# EAGLE design boatColorControlBiggerButtonV4 (EAGLE 8.6.3)
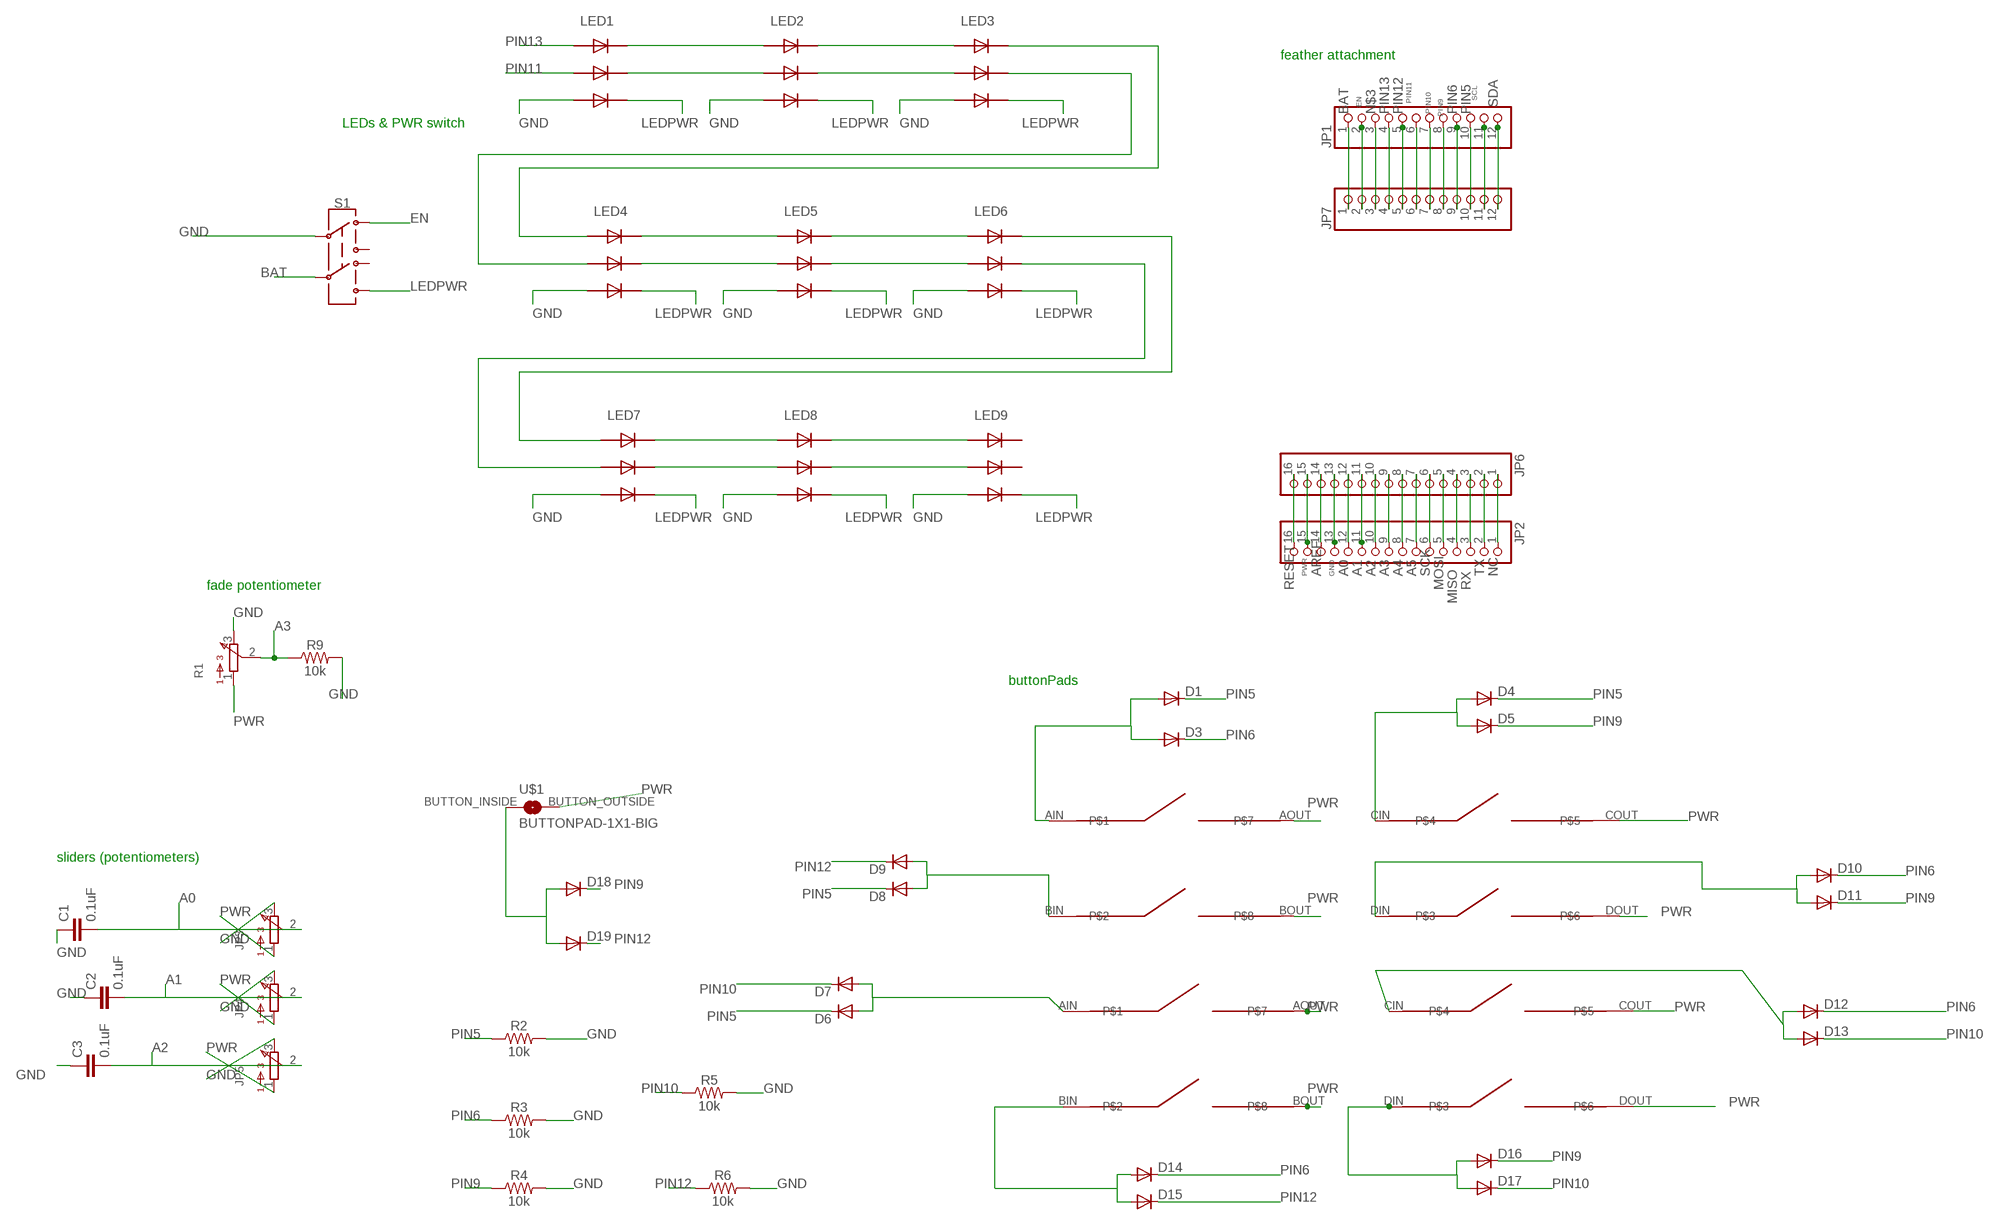
[diagram p0: schematic, sheet 1]

## Parts
C1  0.1uF  0.1UF-0603-25V-5%  [0603]
C2  0.1uF  0.1UF-0603-25V-5%  [0603]
C3  0.1uF  0.1UF-0603-25V-5%  [0603]
D1  DIODESOD123  [SOD123]
D3  DIODESOD123  [SOD123]
D4  DIODESOD123  [SOD123]
D5  DIODESOD123  [SOD123]
D6  DIODESOD123  [SOD123]
D7  DIODESOD123  [SOD123]
D8  DIODESOD123  [SOD123]
D9  DIODESOD123  [SOD123]
D10  DIODESOD123  [SOD123]
D11  DIODESOD123  [SOD123]
D12  DIODESOD123  [SOD123]
D13  DIODESOD123  [SOD123]
D14  DIODESOD123  [SOD123]
D15  DIODESOD123  [SOD123]
D16  DIODESOD123  [SOD123]
D17  DIODESOD123  [SOD123]
D18  DIODESOD123  [SOD123]
D19  DIODESOD123  [SOD123]
JP1  PINHD-1X12  [1X12]
JP2  PINHD-1X16  [1X16]
JP3  BOURNESPOTENTIOMETER  [BOURNESPOTENTIOMETER]
JP4  BOURNESPOTENTIOMETER  [BOURNESPOTENTIOMETER]
JP5  BOURNESPOTENTIOMETER  [BOURNESPOTENTIOMETER]
JP6  PINHD-1X16  [1X16]
JP7  PINHD-1X12  [1X12]
LED1  RGBLED_DOTSTAR5050  [RGBLED5050_DOTSTAR]
LED2  RGBLED_DOTSTAR5050  [RGBLED5050_DOTSTAR]
LED3  RGBLED_DOTSTAR5050  [RGBLED5050_DOTSTAR]
LED4  RGBLED_DOTSTAR5050  [RGBLED5050_DOTSTAR]
LED5  RGBLED_DOTSTAR5050  [RGBLED5050_DOTSTAR]
LED6  RGBLED_DOTSTAR5050  [RGBLED5050_DOTSTAR]
LED7  RGBLED_DOTSTAR5050  [RGBLED5050_DOTSTAR]
LED8  RGBLED_DOTSTAR5050  [RGBLED5050_DOTSTAR]
LED9  RGBLED_DOTSTAR5050  [RGBLED5050_DOTSTAR]
R1  PTV_BOURNES_POT  [PVT_BOURNES_POT]
R2  10k  10KOHM-0603-1/10W-1%  [0603]
R3  10k  10KOHM-0603-1/10W-1%  [0603]
R4  10k  10KOHM-0603-1/10W-1%  [0603]
R5  10k  10KOHM-0603-1/10W-1%  [0603]
R6  10k  10KOHM-0603-1/10W-1%  [0603]
R9  10k  10KOHM-0603-1/10W-1%  [0603]
S1  SWITCH-DPDT-PTH-GPI-152-3013  [SWITCH_DPDT_CRFS-2202W]
U$1  BUTTONPAD-1X1-BIG  [BUTTONPAD-1X1]
U$9  BUTTONPAD2X2  [BUTTONPAD-2X2]
U$13  BUTTONPAD2X2  [BUTTONPAD-2X2]

## Nets
A0: C1.2 JP2.12 JP3.2 JP6.12
A1: C2.2 JP2.11 JP4.2 JP6.11
A2: C3.2 JP2.10 JP5.2 JP6.10
A3: JP2.9 JP6.9 R1.2 R9.1
A4: JP2.8 JP6.8
A5: JP2.7 JP6.7
AREF: JP2.14 JP6.14
BAT: JP1.1 JP7.1 S1.C@2
EN: JP1.2 JP7.2 S1.10
GND: C1.1 C2.1 C3.1 JP2.13 JP3.3 JP4.3 JP5.3 JP6.13 LED1.GND LED2.GND LED3.GND LED4.GND LED5.GND LED6.GND LED7.GND LED8.GND LED9.GND R1.3 R2.2 R3.2 R4.2 R5.2 R6.2 R9.2 S1.C@1
LEDPWR: LED1.VCC LED2.VCC LED3.VCC LED4.VCC LED5.VCC LED6.VCC LED7.VCC LED8.VCC LED9.VCC S1.21
MISO: JP2.4 JP6.4
MOSI: JP2.5 JP6.5
N$3: JP1.3 JP7.3
N$4: LED1.DATAOUT LED2.DATAIN
N$5: LED1.CLOCKOUT LED2.CLOCKIN
N$6: LED2.DATAOUT LED3.DATAIN
N$7: LED2.CLOCKOUT LED3.CLOCKIN
N$8: LED4.DATAOUT LED5.DATAIN
N$9: LED4.CLOCKOUT LED5.CLOCKIN
N$10: LED5.DATAOUT LED6.DATAIN
N$11: LED5.CLOCKOUT LED6.CLOCKIN
N$12: LED7.DATAOUT LED8.DATAIN
N$13: LED7.CLOCKOUT LED8.CLOCKIN
N$14: LED8.DATAOUT LED9.DATAIN
N$15: LED8.CLOCKOUT LED9.CLOCKIN
N$16: LED3.CLOCKOUT LED4.CLOCKIN
N$17: LED3.DATAOUT LED4.DATAIN
N$18: LED6.DATAOUT LED7.DATAIN
N$19: LED6.CLOCKOUT LED7.CLOCKIN
N$21: D1.ANODE(A) D3.ANODE(A) U$9.AIN
N$22: D4.ANODE(A) D5.ANODE(A) U$9.CIN
N$23: D6.ANODE(A) D7.ANODE(A) U$13.AIN
N$24: D8.ANODE(A) D9.ANODE(A) U$9.BIN
N$25: D10.ANODE(A) D11.ANODE(A) U$9.DIN
N$26: D12.ANODE(A) D13.ANODE(A) U$13.CIN
N$27: D14.ANODE(A) D15.ANODE(A) U$13.BIN
N$28: D16.ANODE(A) D17.ANODE(A) U$13.DIN
N$30: D18.ANODE(A) D19.ANODE(A) U$1.BUTTON_INSIDE(BUTTONINSIDE)
NC: JP2.1 JP6.1
PIN5: D1.CATHODE(C) D4.CATHODE(C) D6.CATHODE(C) D8.CATHODE(C) JP1.10 JP7.10 R2.1
PIN6: D3.CATHODE(C) D10.CATHODE(C) D12.CATHODE(C) D14.CATHODE(C) JP1.9 JP7.9 R3.1
PIN9: D5.CATHODE(C) D11.CATHODE(C) D16.CATHODE(C) D18.CATHODE(C) JP1.8 JP7.8 R4.1
PIN10: D7.CATHODE(C) D13.CATHODE(C) D17.CATHODE(C) JP1.7 JP7.7 R5.1
PIN11: JP1.6 JP7.6 LED1.CLOCKIN
PIN12: D9.CATHODE(C) D15.CATHODE(C) D19.CATHODE(C) JP1.5 JP7.5 R6.1
PIN13: JP1.4 JP7.4 LED1.DATAIN
PWR: JP2.15 JP3.1 JP4.1 JP5.1 JP6.15 R1.1 U$1.BUTTON_OUTSIDE(BUTTONOUTSIDE) U$9.AOUT U$9.BOUT U$9.COUT U$9.DOUT U$13.AOUT U$13.BOUT U$13.COUT U$13.DOUT
RESET: JP2.16 JP6.16
RX: JP2.3 JP6.3
SCK: JP2.6 JP6.6
SCL: JP1.11 JP7.11
SDA: JP1.12 JP7.12
TX: JP2.2 JP6.2
Unconnected: LED9.CLOCKOUT LED9.DATAOUT S1.11 S1.20

## Notes on the sheet
- feather attachment
- LEDs & PWR switch
- fade potentiometer
- buttonPads
- sliders (potentiometers)

## Library data of the parts
C1-C3 = SparkFun-Capacitors:0.1UF: 0.1µF ceramic capacitors A capacitor is a passive two-terminal electrical component used to store electrical energy temporarily in an electric field.; PROD_ID: CAP-08604
D1 D3-D19 = trellisLaura:DIODE: DIODE high speed (Philips)
JP1 JP7 = pinhead:PINHD-1X12: PIN HEADER
JP2 JP6 = pinhead:PINHD-1X16: PIN HEADER
JP3-JP5 = trellisLaura:BOURNESPOTENTIOMETER: Laura custom potentiometer https://www.digikey.com/product-detail/en/bourns-inc/PTA4543-2010CIB103/PTA4543-2010CIB103-ND/3781197 Part ID: Bourns Inc. PTA4543-2010CIB103 Datasheet: http://www.bourns.com/docs/Product-Datasheets/pta.pdf
LED1-LED9 = trellisLaura:RGBLED_DOTSTAR: For 5050 RGB LEDs, the order of the LEDs may vary from one manufacturer to another!
R1 = trellisLaura:PTV_BOURNES_POT: PVT09 Series Potentiometer from Bournes http://www.bourns.com/docs/Product-Datasheets/PTV09.pdf part created by hand by Laura Feb 2018
R2-R6 R9 = SparkFun-Resistors:10KOHM: 10kΩ resistor A resistor is a passive two-terminal electrical component that implements electrical resistance as a circuit element. Resistors act to reduce current flow, and, at the same time, act to lower voltage levels within circuits. - Wikipedia; PROD_ID: RES-00824
S1 = trellisLaura:SWITCH-DPDT: Double-Pole, Double-Throw (DPDT) Switch Double-pole, double-throw switches. Variant Overview PTH-GPI-152-3013 Used on SparkFun Geiger Counter <https://www.sparkfun.com/products/11345> SMD-AY0202 Surface Mount DPDT Switch <https://www.sparkfun.com/products/597> (COM-00597) Used on e.g. LilyPad Arduino USB - ATmega32U4 Board <https://www.sparkfun.com/products/12049>; PROD_ID: SWCH-10554
U$1 = trellisLaura:BUTTONPAD-1X1-BIG
U$9 U$13 = trellisLaura:BUTTONPAD2X2

## Net classes
0 default: width 0.152 mm, drill 0.254 mm, clearance 0.205 mm

## Board
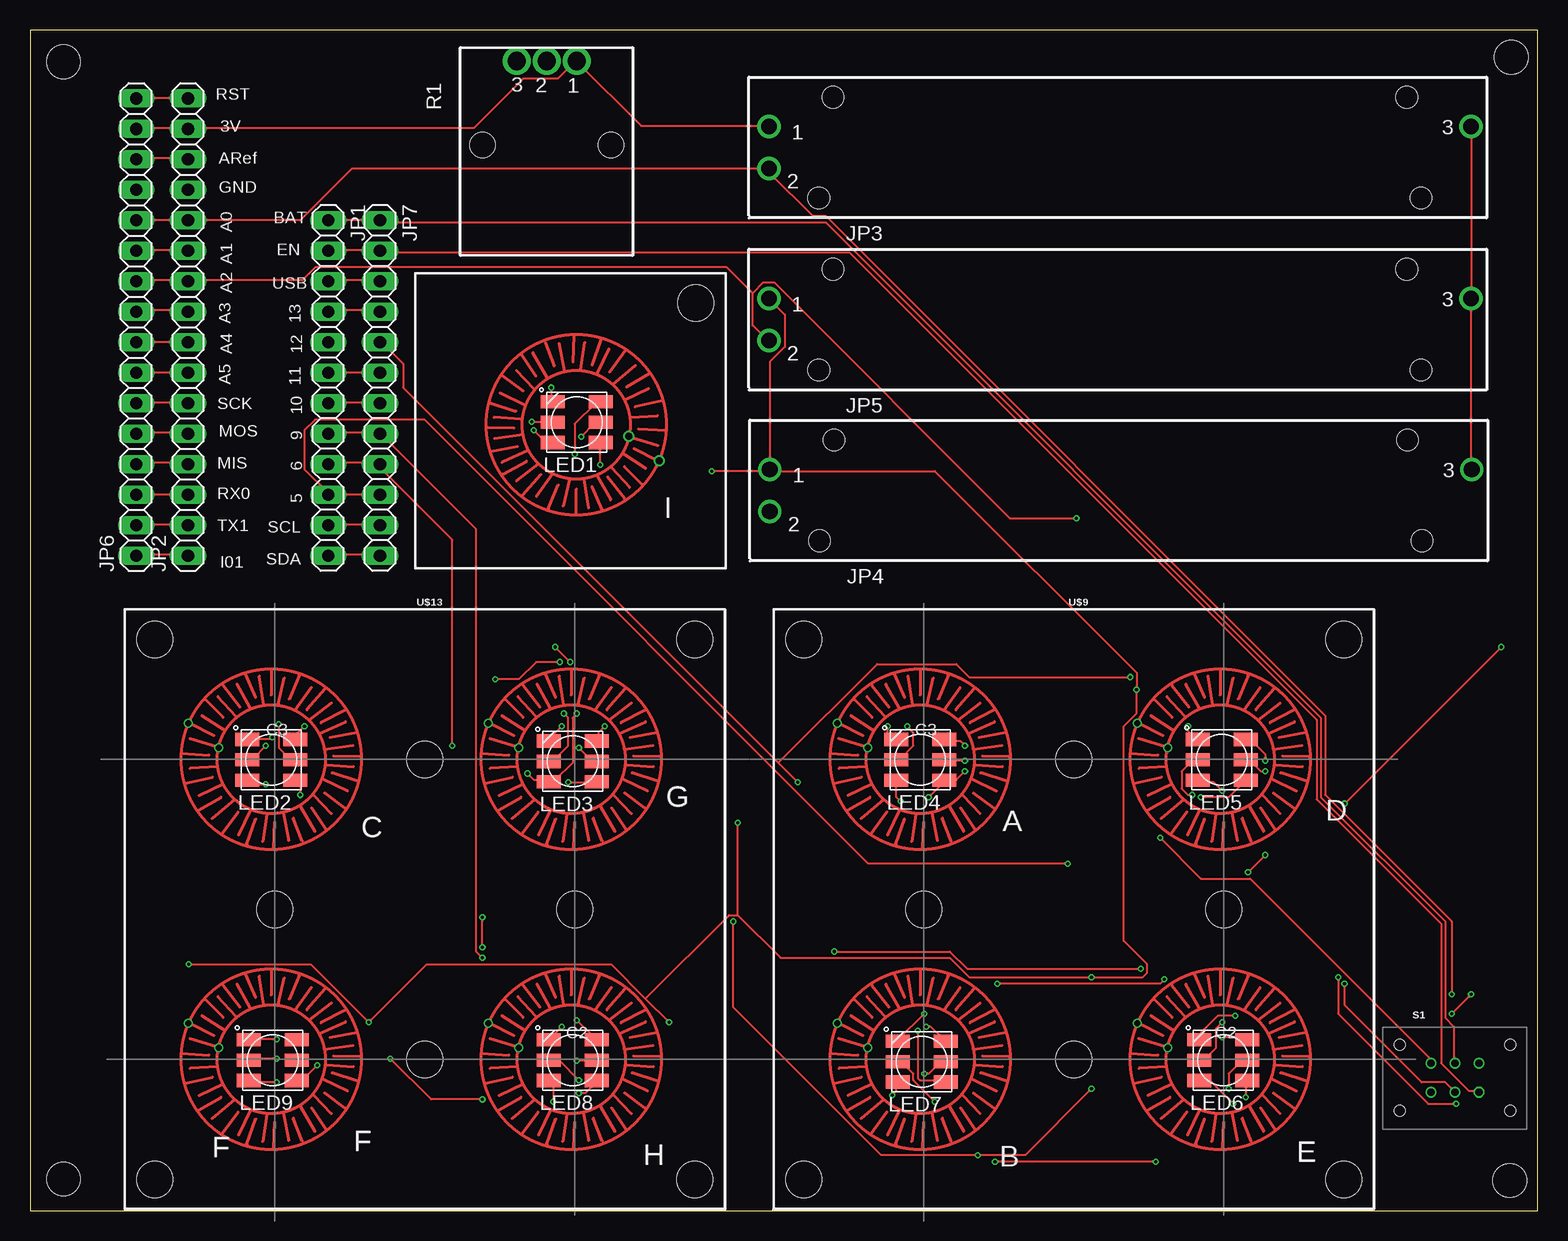
[diagram p1: board, top side]
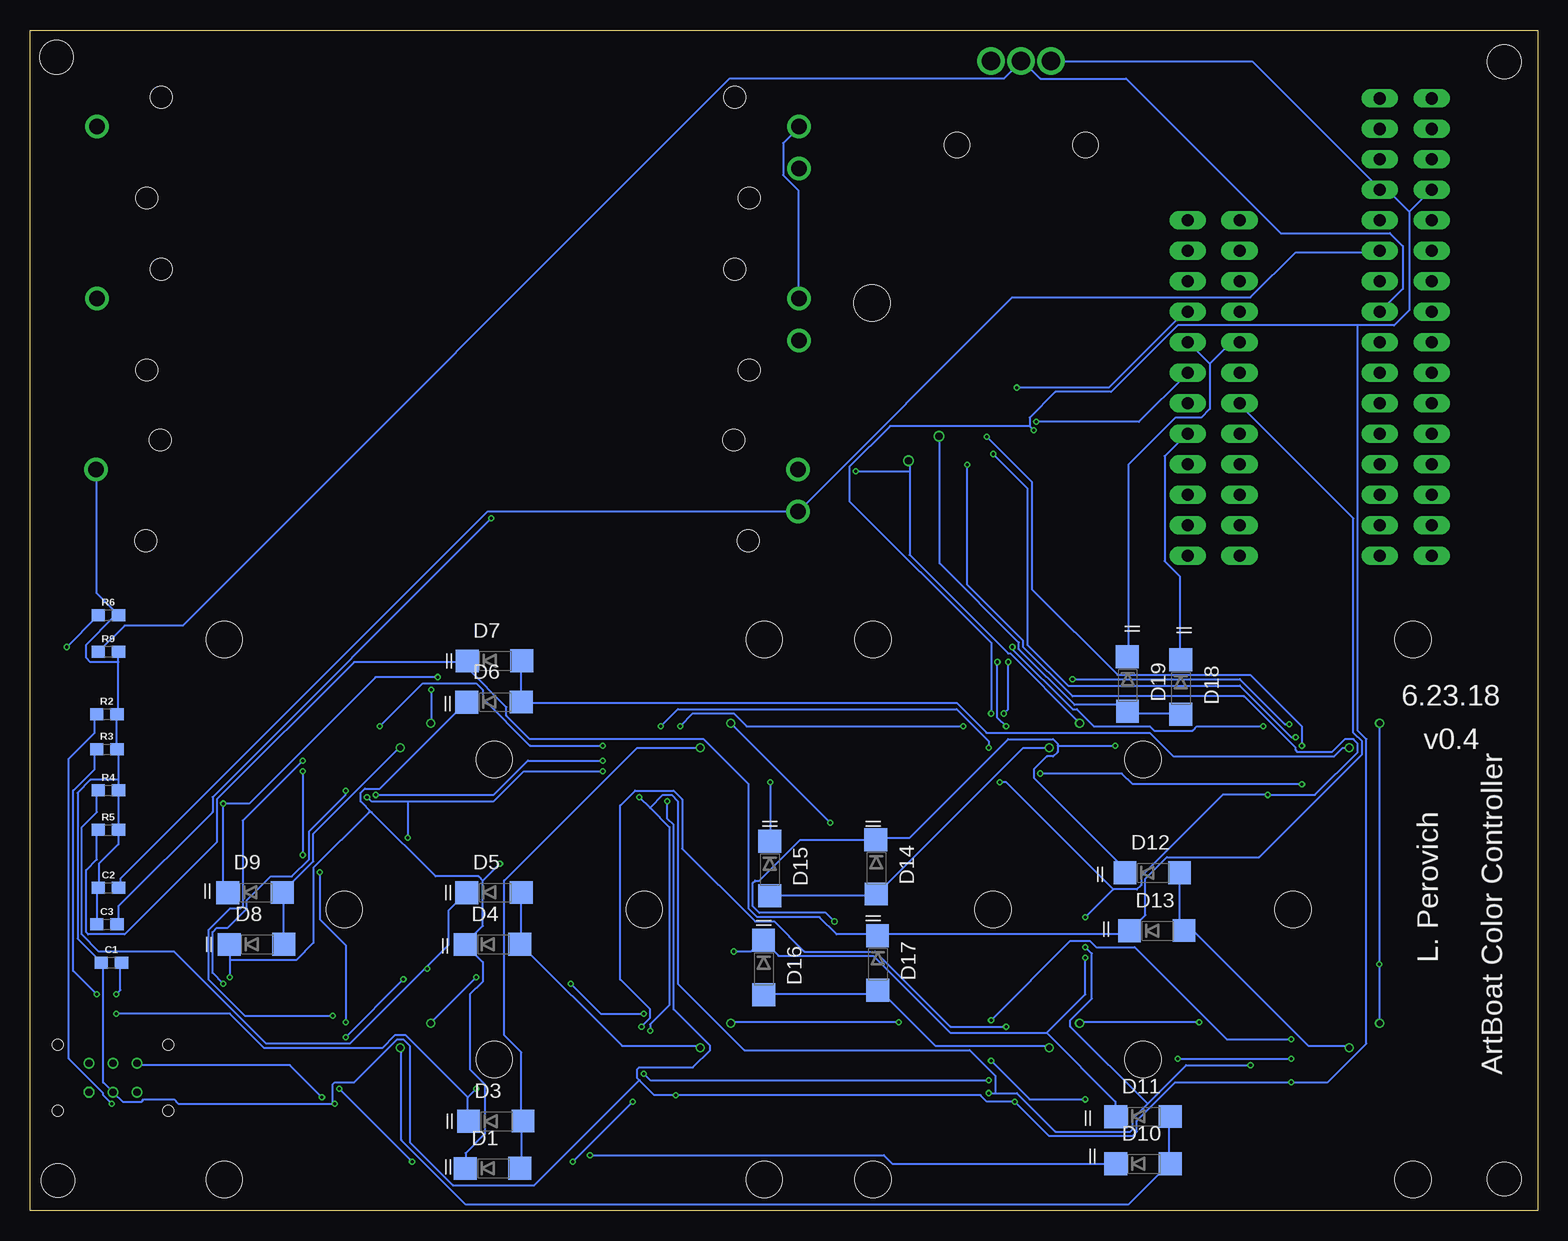
[diagram p2: board, bottom side, seen from below]

Size 125.65 x 98.42 mm. Coordinates in mm from the lower left corner, seen from the top.
Outline: 0,0 125.65,0 125.65,98.42 0,98.42 0,0
Copper layers (1*16): Top 0.035559375mm / dielectric 1.6mm / Bottom 0.035559375mm
Design rules "oshpark-2layer": minimum track width 6mil, minimum drill 10mil, track to track 6mil, track to pad 6mil, pad to pad 6mil, via to via 6mil, smd to smd 6mil, copper to edge 15mil, drill to drill 6mil, minimum pad ring 5mil, minimum via ring 5mil, stop-mask expansion 2.5mil, vias tented up to drill 0mil, thermal gap 10mil
Holes 2.8 mm at 2.79,95.76 123.44,96.14 123.32,2.54 2.79,2.67
vRestrict: area 46.3,63.2 to 48.9,68.3; area 42.3,63.1 to 44.9,68.3; area 20.7,34.9 to 23.5,40.1; area 46,34.8 to 48.5,40; area 41.8,34.9 to 44.5,40; area 74.8,34.9 to 77.6,40.1; area 70.7,35.1 to 73.5,40.1; area 99.9,34.9 to 102.6,40.1; area 95.6,35.1 to 98.7,40.1; area 100.2,9.8 to 102.7,15.1; area 95.8,10 to 98.8,15; area 74.9,9.8 to 77.6,15; 35 more areas

### Footprints (pad centres in the part's own frame; a part is rotated, then mirrored left to right if it is on the bottom)
0603 = smd 1.1 x 1: 1 -0.85,0; 2 0.85,0
SOD123 = smd 1.905 x 1.905: ANODE 2.165,0; CATHODE -2.375,-0.014
1X12 = drill 1.016 long: 1 -13.97,0; 2 -11.43,0; 3 -8.89,0; 4 -6.35,0; 5 -3.81,0; 6 -1.27,0; 7 1.27,0; 8 3.81,0; 9 6.35,0; 10 8.89,0; 11 11.43,0; 12 13.97,0
1X16 = drill 1.016 long: 1 -19.05,0; 2 -16.51,0; 3 -13.97,0; 4 -11.43,0; 5 -8.89,0; 6 -6.35,0; 7 -3.81,0; 8 -1.27,0; 9 1.27,0; 10 3.81,0; 11 6.35,0; 12 8.89,0; 13 11.43,0; 14 13.97,0; 15 16.51,0; 16 19.05,0
BOURNESPOTENTIOMETER = drill 1.3 pad 1.7: 1 0,3.5; 2 0,0; 3 58.5,3.5 | hole 1.8: 5.35,5.95; 53.15,5.95; 4.15,-2.45; 54.35,-2.45
RGBLED5050_DOTSTAR = smd 2 x 1.1: CLOCKIN 1.81,0; CLOCKOUT 5.81,0; DATAIN 1.81,1.7; DATAOUT 5.81,1.7; GND 1.81,-1.7; VCC 5.81,-1.7
PVT_BOURNES_POT = drill 1.53 pad 1.58: 1 -2.5,0; 2 0,0; 3 2.5,0 | hole 2.1: 5.35,7; -5.35,7
SWITCH_DPDT_CRFS-2202W = drill 0.6 pad 0.8 octagon: 10 -2,1.4 | drill 0.6 pad 0.8: 11 -2,-1; 20 2,1.4; 21 2,-1; C@1 0,1.4; C@2 0,-1 | hole 0.9: -4.6,2.95; 4.6,2.95; 4.6,-2.55; -4.6,-2.55
BUTTONPAD-1X1 = drill 0.6: BUTTON_INSIDE 8.082,13.608; BUTTON_OUTSIDE 5.542,15.64 | hole 3: 2.5,2.5
BUTTONPAD-2X2 = drill 0.508: AIN 7.828,38.481; AOUT 5.288,40.513; BIN 32.828,38.481; BOUT 30.288,40.513; CIN 7.828,13.481; COUT 5.288,15.513; DIN 32.828,13.481; DOUT 30.288,15.513 | hole 3: 12.5,25; 25,37.5; 37.5,25; 25,12.5; 2.5,2.5; 2.5,47.5; 47.5,47.5; 47.5,2.5

### Placement (x,y rotation side)
C1  118.87,20.7 0 bottom
C2  119.13,26.92 0 bottom
C3  119.25,23.88 0 bottom
D1  87,3.56 0 bottom
D3  86.74,7.49 0 bottom
D4  87,22.23 0 bottom
D5  86.87,26.54 0 bottom
D6  86.87,42.42 0 bottom
D7  86.85,45.85 0 bottom
D8  106.68,22.23 0 bottom
D9  106.81,26.54 0 bottom
D10  32.8,3.94 0 bottom
D11  32.8,7.87 0 bottom
D12  32.03,28.19 0 bottom
D13  31.65,23.37 0 bottom
D14  55.15,28.57 270 bottom
D15  64.01,28.45 270 bottom
D16  64.52,20.19 270 bottom
D17  55.02,20.57 270 bottom
D18  29.75,43.56 270 bottom
D19  34.19,43.81 270 bottom
JP1  24.85,68.58 270 top
JP2  13.17,73.66 90 top
JP3  61.57,86.87 0 top
JP4  61.65,58.29 0 top
JP5  61.57,72.53 0 top
JP6  8.85,73.66 90 top
JP7  29.17,68.58 270 top
LED1  41.75,65.73 0 top
LED2  16.29,37.59 0 top
LED3  41.43,37.47 0 top
LED4  70.36,37.59 0 top
LED5  95.5,37.59 0 top
LED6  95.63,12.57 0 top
LED7  70.48,12.45 0 top
LED8  41.43,12.57 0 top
LED9  16.41,12.57 0 top
R1  43.06,95.84 180 top
R2  119.25,41.4 0 bottom
R3  119.25,38.48 0 bottom
R4  119.13,35.05 0 bottom
R5  119.13,31.75 0 bottom
R6  119.13,49.66 0 bottom
R9  119.13,46.61 0 bottom
S1  118.75,11.3 180 top
U$1  57.99,78.16 180 top
U$9  61.98,0.13 0 top
U$13  7.9,0.13 0 top

### Tracks (layer width: path | path; a pad name or v marks a point on that pad's centre or on a via)
A0  (via drill 0.25)
  Top 0.152: JP6.12 8.94,82.56 13.04,82.56 JP2.12 13.22,82.56 22.52,82.56 26.8,86.85 61.47,86.85 JP3.2 61.65,86.85 61.65,86.49 65.22,82.92 66.3,82.92 107.94,41.28 107.94,34.67 118.48,24.12 v118.48,18.05
  Bottom 0.152: v118.48,18.05 118.12,18.41 118.12,20.55 C1.2
A1
  Top 0.152: JP6.11 8.94,80.06 13.04,80.06 JP2.11
  Bottom 0.152: C2.2 118.12,26.98 118.12,27.7 87.56,58.26 61.65,58.26 JP4.2 61.47,58.44 43.78,76.13 23.95,76.13 20.19,79.88 13.22,79.88 JP2.11
A2  (via drill 0.25)
  Top 0.152: JP6.10 8.94,77.56 13.04,77.56 JP2.10 13.22,77.56 22.7,77.56 23.77,78.63 58.08,78.63 60.22,76.48 | v87.21,57.72 81.67,57.72 62.01,77.38 61.12,77.38 60.22,76.48 | 60.22,76.48 60.22,73.8 61.47,72.55 JP5.2
  Bottom 0.152: v87.21,57.72 110.44,34.49 110.44,33.24 118.3,25.38 118.3,23.95 C3.2
A3
  Top 0.152: JP6.9 8.94,75.05 13.04,75.05 JP2.9
  Bottom 0.152: R9.1 119.91,46.64 117.76,48.78 112.94,48.78 67.37,94.35 44.5,94.35 43.07,95.78 R1.2 42.89,95.78 41.46,94.35 34.31,94.35 21.44,81.49 12.33,81.49 11.26,80.42 11.26,76.84 13.04,75.05 JP2.9
A4
  Top 0.152: JP6.8 8.94,72.37 13.04,72.37 JP2.8
A5
  Top 0.152: JP6.7 8.94,69.87 13.04,69.87 JP2.7
AREF
  Top 0.152: JP6.14 8.94,87.74 13.04,87.74 JP2.14
BAT
  Top 0.152: S1.C@2 118.66,12.33 118.66,15.37 117.94,16.08 117.94,24.12 107.58,34.49 107.58,41.1 66.3,82.38 29.31,82.38 JP7.1 29.13,82.56 25.02,82.56 JP1.1
EN
  Top 0.152: S1.10 120.62,10.01 119.91,10.01 117.58,12.33 117.58,23.95 107.22,34.31 107.22,40.92 68.26,79.88 29.31,79.88 JP7.2 29.13,80.06 25.02,80.06 JP1.2
GND  (via drill 0.25)
  Top 0.152: v41.46,36.45 41.99,35.92 43.07,35.92 LED3.GND 43.24,35.92 43.78,35.92 45.21,37.35 45.21,41.1 v45.57,41.46 | v19.66,35.56 18.41,35.56 18.23,35.74 LED2.GND | v41.99,65.05 42.89,64.15 43.42,64.15 LED1.GND | v20.55,10.72 18.23,10.72 LED9.GND | v43.6,9.11 43.6,10.37 43.24,10.72 LED8.GND | v71.84,9.65 72.19,10.01 72.19,10.72 LED7.GND | v72.55,34.13 72.19,34.49 72.19,35.74 LED4.GND | v100.25,8.94 98.46,10.72 97.57,10.72 LED6.GND | v99.36,35.02 98.64,35.74 97.39,35.74 LED5.GND | v109.54,18.94 109.54,17.16 115.98,10.72 117.94,10.72 118.66,10.01 S1.C@1 | JP3.3 120.09,90.24 120.09,76.13 JP5.3 120.09,75.95 120.09,61.83 JP4.3
  Bottom 0.152: v41.46,36.45 34.67,36.45 33.77,35.56 v19.66,35.56 | 42.35,65.4 v41.99,65.05 | 42.35,65.4 42.35,66.12 40.21,68.26 35.56,68.26 30.02,73.8 15.01,73.8 | 15.01,73.8 11.97,73.8 10.72,75.05 10.72,83.27 | 10.72,83.27 8.94,85.06 JP6.13 | 10.72,83.27 12.51,85.06 13.04,85.06 JP2.13 13.22,85.24 23.77,95.78 40.39,95.78 R1.3 | v45.57,41.46 45.57,47.35 57.36,59.15 57.36,62.01 53.97,65.4 42.35,65.4 | v72.55,34.13 72.55,32.7 72.02,32.17 72.02,16.8 68.98,13.76 68.98,13.4 70.41,11.97 74.88,11.97 75.05,11.79 75.05,11.08 74.88,10.9 | 74.88,10.9 73.62,9.65 v71.84,9.65 46.46,9.65 45.93,9.11 v43.6,9.11 40.74,6.25 33.77,6.25 33.42,6.61 33.42,7.5 30.2,10.72 v20.55,10.72 17.51,10.72 14.3,13.94 14.3,39.31 15.01,40.03 15.01,73.8 | 100.43,8.94 113.3,8.94 113.65,9.29 116.16,9.29 116.33,9.11 117.94,9.11 118.66,9.83 S1.C@1 118.83,10.01 119.55,10.72 119.55,20.55 C1.1 119.73,20.73 121.69,22.7 121.69,34.85 120.62,35.92 118.3,35.92 | v99.36,35.02 99.36,34.67 102.39,31.63 102.39,29.31 103.83,27.88 105.61,27.88 107.58,25.91 107.58,25.2 109.19,23.59 110.08,23.59 110.44,23.23 110.44,19.84 v109.54,18.94 | C3.1 120.09,23.95 120.09,26.8 C2.1 119.91,26.98 119.91,28.95 118.3,30.56 118.3,31.63 R5.2 118.3,31.81 118.3,35.02 R4.2 118.3,35.2 118.3,35.92 | 118.3,45.75 118.3,41.46 R2.2 118.48,41.28 118.48,38.6 R3.2 118.3,38.42 118.3,35.92 | 118.3,45.75 118.3,46.46 R9.2 | 118.3,45.75 120.62,45.75 120.98,46.1 120.98,47.18 118.66,49.5 118.3,49.5 R6.2 118.3,49.68 120.09,51.47 120.09,61.65 JP4.3 | 74.88,10.9 83.63,2.14 90.42,2.14 94,5.72 94,13.76 94.53,14.3 95.07,14.3 98.64,10.72 100.25,10.72 100.43,10.54 100.43,8.94
  Bottom 0.152: 100.43,8.94 v100.25,8.94
LEDPWR  (via drill 0.25)
  Top 0.152: v44.85,35.74 47.18,35.74 LED3.VCC | v22.52,34.67 22.52,35.38 22.16,35.74 LED2.VCC | v47.53,62.19 47.53,63.98 LED1.VCC | v23.95,12.15 22.7,10.9 22.34,10.9 LED9.VCC | v45.75,9.83 46.28,9.83 47.18,10.72 LED8.VCC | v101.32,9.47 101.32,10.72 LED6.VCC | v77.91,36.63 77.2,35.92 76.31,35.92 LED4.VCC 76.13,35.74 v74.88,34.49 | v97.57,34.49 99.89,34.49 101.14,35.74 LED5.VCC | v73.98,15.01 73.98,11.08 74.16,10.9 76.13,10.9 LED7.VCC | v94.17,31.09 97.57,27.7 101.68,27.7 116.69,12.69 116.69,12.33 S1.21 | v37.71,21.98 v37.71,24.48
  Bottom 0.152: v44.85,35.74 44.32,35.74 35.38,26.8 | 35.38,26.8 33.42,26.8 33.06,27.16 33.06,27.88 26.27,34.67 v22.52,34.67 18.59,34.67 15.01,38.24 15.01,38.96 15.37,39.31 16.08,39.31 17.16,38.24 20.01,38.24 20.19,38.42 20.19,38.6 24.48,42.89 38.78,42.89 42.89,47 42.89,47.53 47.53,52.18 v47.53,62.19 | v23.95,12.15 29.31,12.15 32.52,8.94 | 32.52,8.94 33.77,7.68 33.77,6.79 33.95,6.61 40.21,6.61 43.42,9.83 45.21,9.83 | v45.75,9.83 45.21,9.83 | v101.32,9.47 104,12.15 116.69,12.15 S1.21 | v77.91,36.63 84.53,36.63 87.03,34.13 94.17,34.13 | 94.17,34.13 97.21,34.13 v97.57,34.49 | v73.98,15.01 73.98,15.55 72.37,17.16 72.37,31.99 73.98,33.6 | v74.88,34.49 73.98,33.6 | 94.17,34.13 v94.17,31.09 | 45.21,9.83 45.21,11.26 47.35,13.4 66.12,13.4 71.66,18.94 71.66,34.13 72.19,34.67 72.91,34.67 73.98,33.6 | v37.71,24.48 35.38,26.8 | v37.71,21.98 37.17,21.44 37.17,17.69 38.96,15.9 38.96,15.37 32.52,8.94
MISO
  Top 0.152: JP6.4 8.94,62.37 13.04,62.37 JP2.4
MOSI
  Top 0.152: JP6.5 8.94,64.87 13.04,64.87 JP2.5
N$3
  Top 0.152: JP1.3 25.02,77.56 29.13,77.56 JP7.3
N$4  (via drill 0.25)
  Top 0.152: v20.19,39.49 20.01,39.31 18.23,39.31 LED2.DATAIN | v45.39,63.08 45.39,65.58 47.18,67.37 47.53,67.37 LED1.DATAOUT
  Bottom 0.152: v20.19,39.49 20.55,39.49 24.84,43.78 39.13,43.78 42.53,47.18 42.53,60.22 v45.39,63.08
N$5  (via drill 0.25)
  Top 0.152: v19.66,38.78 18.59,37.71 18.23,37.71 LED2.CLOCKIN | v45.93,64.51 47,65.58 47.53,65.58 LED1.CLOCKOUT
  Bottom 0.152: v19.66,38.78 19.66,40.39 23.95,44.67 35.02,44.67 42.17,51.82 42.17,60.76 v45.93,64.51
N$6  (via drill 0.25)
  Top 0.152: v22.87,40.39 22.16,39.67 22.16,39.31 LED2.DATAOUT | v45.03,45.75 v43.78,47 | v44.32,40.39 43.24,39.31 LED3.DATAIN
  Bottom 0.152: v22.87,40.39 28.41,40.39 28.77,40.03 31.99,40.03 32.34,40.39 36.99,40.39 38.42,41.82 38.78,41.82 43.78,46.82 v43.78,47 | v45.03,45.75 45.03,41.1 v44.32,40.39
N$7  (via drill 0.25)
  Top 0.152: v20.73,40.56 20.73,38.6 21.62,37.71 21.98,37.71 LED2.CLOCKOUT | v38.78,44.32 40.74,44.32 42.17,45.75 v44.14,45.75 | v44.5,41.46 44.85,41.1 44.85,38.78 43.6,37.53 43.24,37.53 LED3.CLOCKIN
  Bottom 0.152: v20.73,40.56 21.09,40.56 24.84,44.32 v38.78,44.32 | v44.14,45.75 44.14,41.82 v44.5,41.46
N$8  (via drill 0.25)
  Top 0.152: v77.91,38.78 77.56,39.13 76.31,39.13 LED4.DATAOUT | v96.5,40.39 96.5,40.03 97.21,39.31 LED5.DATAIN
  Bottom 0.152: v77.91,38.78 83.99,38.78 87.92,42.71 87.92,43.42 88.46,43.96 92.92,43.96 v96.5,40.39
N$9  (via drill 0.25)
  Top 0.152: v77.91,37.53 76.31,37.53 LED4.CLOCKOUT | v96.86,34.67 96.5,34.67 95.96,35.2 95.96,36.63 96.86,37.53 97.21,37.53 LED5.CLOCKIN
  Bottom 0.152: v77.91,37.53 84.17,37.53 87.03,34.67 v96.86,34.67
N$10  (via drill 0.25)
  Top 0.152: v100.43,16.26 99,16.26 97.57,14.83 97.57,14.3 LED6.DATAIN | v102.93,37.53 102.93,38.06 101.86,39.13 101.32,39.13 LED5.DATAOUT
  Bottom 0.152: v100.43,16.26 107.76,16.26 110.79,19.3 110.79,23.41 109.01,25.2 108.11,25.2 107.94,25.38 107.94,32.52 v102.93,37.53
N$11  (via drill 0.25)
  Top 0.152: v99.36,15.73 98.82,15.19 98.82,13.58 97.93,12.69 97.57,12.69 LED6.CLOCKIN | v102.93,29.66 v101.5,28.23 | v102.93,36.63 102.57,36.63 101.68,37.53 101.32,37.53 LED5.CLOCKOUT
  Bottom 0.152: v99.36,15.73 99.36,22.16 101.5,24.3 v101.5,28.23 | v102.93,36.63 v102.93,29.66
N$12  (via drill 0.25)
  Top 0.152: v44.32,15.37 43.24,14.3 LED8.DATAIN | v74.7,15.37 75.05,15.37 76.13,14.3 LED7.DATAOUT
  Bottom 0.152: v44.32,15.37 48.96,15.37 55.22,21.62 61.12,21.62 63.62,24.12 65.22,24.12 71.3,30.2 71.3,34.31 72.02,35.02 75.23,35.02 76.48,33.77 76.48,19.3 73.98,16.8 73.98,16.08 v74.7,15.37
N$13  (via drill 0.25)
  Top 0.152: v45.75,10.9 44.14,12.51 43.24,12.51 LED8.CLOCKIN | v74.52,11.44 74.88,11.44 75.77,12.33 76.13,12.33 LED7.CLOCKOUT
  Bottom 0.152: v45.75,10.9 73.98,10.9 v74.52,11.44
N$14  (via drill 0.25)
  Top 0.152: v20.55,14.3 18.23,14.3 LED9.DATAIN | v45.57,15.9 47.18,14.3 LED8.DATAOUT
  Bottom 0.152: v20.55,14.3 25.91,14.3 33.6,21.98 36.81,21.98 37.35,22.52 38.96,22.52 v45.57,15.9
N$15  (via drill 0.25)
  Top 0.152: v20.55,12.69 18.23,12.69 LED9.CLOCKIN | v30.02,12.69 33.42,9.29 v37.71,9.29 | v45.57,12.51 47.18,12.51 LED8.CLOCKOUT
  Bottom 0.152: v30.02,12.69 v20.55,12.69 | v37.71,9.29 42.35,9.29 v45.57,12.51
N$16  (via drill 0.25)
  Top 0.152: v45.75,38.6 46.82,37.53 47.18,37.53 LED3.CLOCKOUT | v73.09,40.39 73.62,39.85 73.62,38.78 72.55,37.71 72.19,37.71 LED4.CLOCKIN
  Bottom 0.152: v45.75,38.6 45.75,39.13 48.43,41.82 71.66,41.82 v73.09,40.39
N$17  (via drill 0.25)
  Top 0.152: v47.89,40.39 47.35,39.85 47.35,39.31 LED3.DATAOUT | v71.48,40.39 71.48,39.85 72.02,39.31 LED4.DATAIN
  Bottom 0.152: v47.89,40.39 65.94,40.39 67.01,41.46 70.41,41.46 v71.48,40.39
N$18  (via drill 0.25)
  Top 0.152: v74.52,16.44 72.37,14.3 LED7.DATAIN | v80.59,18.94 94.17,18.94 v94.53,19.3 | v99.36,14.47 101.14,14.47 101.32,14.3 LED6.DATAOUT
  Bottom 0.152: v74.52,16.44 78.09,16.44 v80.59,18.94 | v99.36,14.47 v94.53,19.3
N$19  (via drill 0.25)
  Top 0.152: v75.41,9.11 73.62,10.9 73.62,11.44 72.73,12.33 72.37,12.33 LED7.CLOCKIN | v93.82,4.11 v80.42,4.11 | v99.89,10.19 99.89,11.44 100.97,12.51 101.32,12.51 LED6.CLOCKOUT
  Bottom 0.152: v80.42,4.11 v75.41,9.11 | v99.89,10.19 v93.82,4.11
N$21
  Bottom 0.152: U$9.AIN 69.87,38.6 75.05,38.6 86.13,27.52 86.13,14.65 84.7,13.22 84.7,7.5 D3.ANODE 84.7,7.33 84.7,3.57 D1.ANODE
N$22
  Bottom 0.152: U$9.CIN 69.87,13.76 76.31,13.76 84.7,22.16 D4.ANODE 84.7,22.34 84.7,26.45 D5.ANODE
N$23
  Bottom 0.152: U$13.AIN 15.9,38.6 16.26,38.6 16.98,37.88 30.38,37.88 32.34,39.85 45.93,39.85 48.43,42.35 84.53,42.35 D6.ANODE 84.7,42.53 84.7,45.75 D7.ANODE
N$24
  Bottom 0.152: U$9.BIN 94.89,38.6 102.04,31.45 102.04,29.13 104.54,26.63 D9.ANODE 104.54,26.45 104.54,22.34 D8.ANODE
N$25
  Bottom 0.152: U$9.DIN 94.71,13.58 94.71,5.9 89.35,0.54 34.13,0.54 30.74,3.93 D10.ANODE 30.74,4.11 30.74,7.86 D11.ANODE
N$26
  Bottom 0.152: U$13.CIN 15.9,13.76 19.12,13.76 28.59,23.23 29.48,23.23 D13.ANODE 29.66,23.41 29.84,23.59 29.84,28.06 D12.ANODE
N$27
  Bottom 0.152: U$13.BIN 40.74,38.6 42.89,38.6 55.04,26.45 D14.ANODE 55.22,26.27 63.98,26.27 D15.ANODE
N$28
  Bottom 0.152: U$13.DIN 40.74,13.76 50.22,13.76 54.86,18.41 D17.ANODE 55.04,18.41 55.4,18.05 64.51,18.05 D16.ANODE
N$30
  Bottom 0.152: U$1.BUTTON_INSIDE 49.86,64.51 49.86,53.97 43.24,47.35 43.24,46.82 38.6,42.17 34.67,42.17 34.31,41.82 D19.ANODE 34.13,41.64 33.95,41.46 29.84,41.46 D18.ANODE
NC
  Top 0.152: JP6.1 8.94,54.68 13.04,54.68 JP2.1
PIN5  (via drill 0.25)
  Top 0.152: v118.83,8.94 116.51,8.94 109.01,16.44 v109.01,19.48 | JP7.10 29.13,59.69 25.02,59.69 JP1.10 24.84,59.86 22.87,61.83 22.87,65.05 23.77,65.94 32.88,65.94 69.87,28.95 v86.49,28.95
  Bottom 0.152: v118.83,8.94 119.55,9.65 119.55,9.83 122.41,12.69 122.41,37.71 120.27,39.85 120.27,41.28 R2.1 | 109.01,20.91 109.01,22.16 D8.CATHODE | 109.01,20.91 v109.01,19.48 | D1.CATHODE 89.35,3.57 89.35,4.83 87.74,6.43 87.74,10.54 88.99,11.79 88.99,18.05 87.92,19.12 87.92,20.73 89.35,22.16 D4.CATHODE 89.35,22.34 87.92,23.77 87.92,27.52 | 97.21,33.24 91.85,27.88 88.28,27.88 87.92,27.52 | 97.21,33.24 98.11,34.13 98.11,34.85 97.75,35.2 96.5,35.2 89.35,42.35 D6.CATHODE | 87.92,27.52 v86.49,28.95 | 109.01,20.91 103.47,20.91 102.04,22.34 102.04,28.59 97.39,33.24 97.21,33.24
PIN6  (via drill 0.25)
  Top 0.152: JP1.9 25.02,62.37 29.13,62.37 JP7.9 29.31,62.19 29.31,61.83 35.2,55.93 v35.2,38.78 | v118.48,16.44 v120.09,18.05 | v88.46,10.19 82.92,4.65 v78.98,4.65 70.94,4.65 58.61,16.98 v58.61,24.12
  Bottom 0.152: 40.03,38.78 40.03,38.96 40.39,39.31 44.14,39.31 52.36,31.09 55.04,31.09 D14.CATHODE 55.22,30.91 61.47,30.91 64.87,27.52 65.22,27.52 65.4,27.34 65.4,25.38 64.87,24.84 59.33,24.84 v58.61,24.12 | 40.03,38.78 40.03,38.24 40.39,37.88 40.92,37.88 41.99,36.81 41.99,36.1 34.49,28.59 34.49,28.23 D12.CATHODE | 40.03,38.78 v35.2,38.78 | v120.09,18.05 122.05,20.01 122.05,35.02 120.27,36.81 120.27,38.42 R3.1 | v118.48,16.44 109.01,16.44 106.15,13.58 96.32,13.58 95.25,14.65 94.35,14.65 89.17,9.47 | 89.17,9.47 89.17,7.5 D3.CATHODE | v78.98,4.65 54.5,4.65 53.79,3.93 35.2,3.93 D10.CATHODE | 89.17,9.47 v88.46,10.19
PIN9  (via drill 0.25)
  Top 0.152: JP1.8 25.02,64.87 29.13,64.87 JP7.8 29.31,64.69 37.17,56.83 37.17,21.62 v37.71,21.09 | v92.57,20.19 78.09,20.19 76.66,21.62 v67.01,21.62
  Bottom 0.152: 92.75,20.19 90.78,22.16 90.78,25.02 89.35,26.45 D5.CATHODE | 92.75,20.19 99,13.94 105.97,13.94 113.65,21.62 119.91,21.62 121.34,23.05 121.34,31.99 120.09,33.24 120.09,35.02 R4.1 | D18.CATHODE 29.84,46.1 29.84,52.9 31.09,54.15 31.09,62.9 29.31,64.69 JP7.8 | 40.92,14.83 35.2,9.11 35.2,7.86 D11.CATHODE | 40.92,14.83 48.96,14.83 55.4,21.27 63.26,21.27 64.51,22.52 D16.CATHODE 64.69,22.52 65.58,21.62 v67.01,21.62 | v37.71,21.09 37.71,18.05 40.92,14.83 | v92.57,20.19 92.75,20.19
PIN10
  Top 0.152: JP1.7 25.02,67.37 29.13,67.37 JP7.7
  Bottom 0.152: R5.1 120.09,31.63 120.09,29.31 120.98,28.41 120.98,23.23 120.8,23.05 117.76,23.05 110.08,30.74 110.08,34.31 98.64,45.75 89.35,45.75 D7.CATHODE 89.17,45.75 89.17,45.21 85.95,41.99 85.95,41.28 83.99,39.31 69.51,39.31 65.76,35.56 65.76,25.2 65.05,24.48 59.86,24.48 58.44,23.05 55.04,23.05 D17.CATHODE 54.86,23.05 34.31,23.05 34.13,23.23 D13.CATHODE 33.95,23.41 32.7,24.66 32.7,27.7 30.91,29.48 23.23,29.48 14.65,38.06 14.65,39.13 15.37,39.85 15.37,57.72 24.84,67.19 JP1.7
PIN11  (via drill 0.25)
  Top 0.152: v41.82,65.76 43.42,65.76 LED1.CLOCKIN | JP1.6 25.02,69.87 29.13,69.87 JP7.6
  Bottom 0.152: v41.82,65.76 33.24,65.76 29.31,69.69 JP7.6
PIN12  (via drill 0.25)
  Top 0.152: v109.54,33.95 v122.59,47 | 62.37,37.35 31.09,68.62 31.09,70.59 29.31,72.37 JP7.5 | 62.37,37.35 v63.98,35.74 | v91.67,44.5 78.27,44.5 77.2,45.57 70.59,45.57 62.37,37.35
  Bottom 0.152: v122.59,47 120.09,49.5 R6.1 | D9.CATHODE 109.19,26.63 109.54,26.98 v109.54,33.95 107.4,33.95 96.86,44.5 v91.67,44.5 | v63.98,35.74 63.98,30.91 D15.CATHODE | 27.34,70.59 27.34,66.83 28.06,66.12 30.2,66.12 34.13,62.19 34.13,46.28 D19.CATHODE | 27.34,70.59 29.13,72.37 JP7.5 | 27.34,70.59 25.55,72.37 25.02,72.37 JP1.5
PIN13  (via drill 0.25)
  Top 0.152: v43.42,68.62 43.42,67.55 LED1.DATAIN | JP1.4 25.02,75.05 29.13,75.05 JP7.4
  Bottom 0.152: v43.42,68.62 35.74,68.62 29.31,75.05 JP7.4
PWR  (via drill 0.25)
  Top 0.152: v13.22,20.55 23.41,20.55 v28.23,15.73 33.06,20.55 48.43,20.55 51.29,17.69 | 51.29,17.69 v53.25,15.73 | 58.97,24.66 62.55,21.09 76.66,21.09 78.27,19.48 v88.46,19.48 92.75,19.48 93.1,19.84 93.1,20.55 91.14,22.52 91.14,40.39 92.21,41.46 v92.21,43.42 92.21,44.85 75.41,61.65 61.65,61.65 JP4.1 | 58.97,24.66 58.26,24.66 51.29,17.69 | 58.97,24.66 v58.97,32.34 | JP4.1 61.65,61.83 61.65,70.77 62.9,72.02 62.9,74.7 61.65,75.95 JP5.1 | JP6.15 8.94,90.24 13.04,90.24 JP2.15 13.22,90.24 36.99,90.24 41.1,94.35 43.96,94.35 45.39,95.78 R1.1 45.57,95.78 50.93,90.42 61.47,90.42 JP3.1 | v56.83,61.65 61.47,61.65 JP4.1
  Bottom 0.152: U$13.COUT 13.22,15.73 v13.22,20.55 13.22,40.56 U$13.AOUT | v28.23,15.73 38.06,15.73 U$13.DOUT | v53.25,15.73 67.19,15.73 U$9.COUT | v88.46,19.48 92.21,15.73 U$9.DOUT | v58.97,32.34 67.19,40.56 U$9.AOUT | v92.21,43.42 92.21,40.74 U$9.BOUT | 52.36,61.65 52.36,62.37 U$1.BUTTON_OUTSIDE | 52.36,61.65 52.36,54.68 44.14,46.46 43.96,46.46 38.24,40.74 U$13.BOUT | JP5.1 61.65,76.13 61.65,85.06 62.9,86.31 62.9,88.99 61.65,90.24 JP3.1 | v56.83,61.65 52.36,61.65
RESET
  Top 0.152: JP6.16 8.94,92.75 13.04,92.75 JP2.16
RX
  Top 0.152: JP6.3 8.94,59.69 13.04,59.69 JP2.3
SCK
  Top 0.152: JP6.6 8.94,67.37 13.04,67.37 JP2.6
SCL
  Top 0.152: JP1.11 25.02,57.18 29.13,57.18 JP7.11
SDA
  Top 0.152: JP1.12 25.02,54.68 29.13,54.68 JP7.12
TX
  Top 0.152: JP6.2 8.94,57.18 13.04,57.18 JP2.2

### Text on the board
tPlace: RST | 3V | ARef | GND | A0 | BAT | A1 | EN | A2 | USB | A3 | 13 | A4 | 12 | A5 | 11 | 10 | SCK | MOS | 9 | MIS | 6 | 5 | RX0 | I | TX1 | SCL | I01 | SDA | G | D | A | C | F | H | B | E
bPlace: || | || | || | || | || | || | || | || | || | || | || | || | || | || | || | || | || | ||
tNames: F
bNames: 6.23.18 | ArtBoat Color Controller | v0.4 | L. Perovich